# Altium schematic sheet MotorSchematic.SchDoc
size A; Organization: Smart Product Design Lab; Address1: 201 Thornton; Address2: Stanford University; Address3: Stanford, CA; Address4: 94305-4021
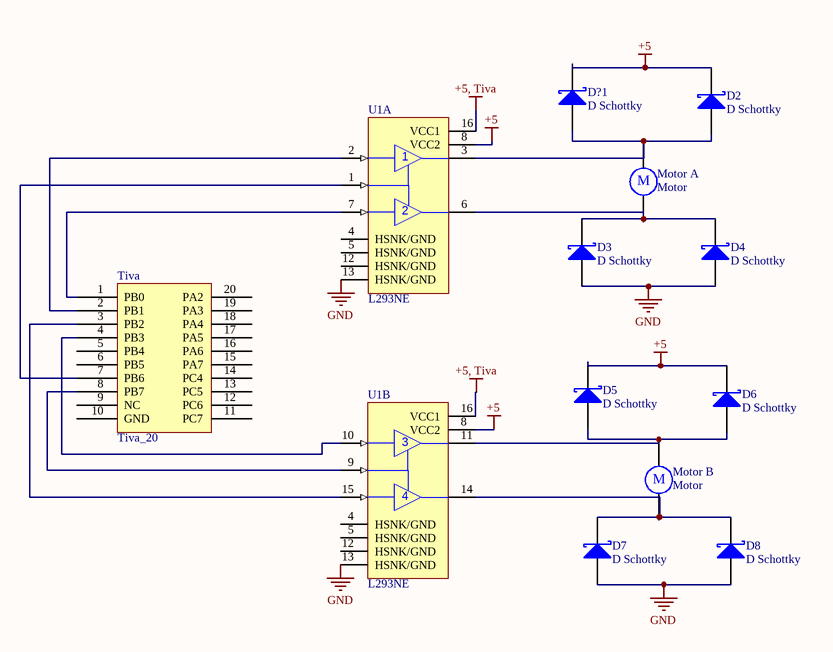
[diagram p0: MotorSchematic.SchDoc]

## Parts
D2  D Schottky  [DSO-C2/X2.3]
D3  D Schottky  [DSO-C2/X2.3]
D4  D Schottky  [DSO-C2/X2.3]
D5  D Schottky  [DSO-C2/X2.3]
D6  D Schottky  [DSO-C2/X2.3]
D7  D Schottky  [DSO-C2/X2.3]
D8  D Schottky  [DSO-C2/X2.3]
D?1  D Schottky  [DSO-C2/X2.3]
Motor_A  Motor  [RB5-10.5]
Motor_B  Motor  [RB5-10.5]
Tiva  Tiva_20
U1  L293NE  [DIP-16/X1.5]  (parts A,B of 2)

## Nets
+5: D2.2(K) D5.2(K) D6.2(K) D?1.2(K) U1.8(VCC2)
+5, Tiva: U1.16(VCC1)
GND: D3.1(A) D4.1(A) D7.1(A) D8.1(A) U1.13(HSNK/GND)
NetD2_1: D2.1(A) D?1.1(A) Motor_A.1 U1.3(1Y)
NetD3_2: D3.2(K) D4.2(K) Motor_A.2 U1.6(2Y)
NetD5_1: D5.1(A) D6.1(A) Motor_B.1 U1.11(3Y)
NetD7_2: D7.2(K) D8.2(K) Motor_B.2 U1.14(4Y)
NetTiva_1: Tiva.1(PB0) U1.7(2A)
NetTiva_2: Tiva.2(PB1) U1.2(1A)
NetTiva_3: Tiva.3(PB2) U1.15(4A)
NetTiva_4: Tiva.4(PB3) U1.10(3A)
NetTiva_7: Tiva.7(PB6) U1.1(1,2EN)
NetTiva_8: Tiva.8(PB7) U1.9(3,4EN)

Not connected (* = marked no-connect by the designer): Tiva 5(PB4) 6(PB5) 9(NC) 10(GND) 11(PC7) 12(PC6) 13(PC5) 14(PC4) 15(PA7) 16(PA6) 17(PA5) 18(PA4) 19(PA3) 20(PA2); U1 4(HSNK/GND) 5(HSNK/GND) 12(HSNK/GND)

## Notes on the sheet
- Title
- Size:
- Date:
- File:
- A
- Number:
- Time:
- Revision:
- Sheet
- of
- Drawn By:
- (in symbol Motor) M

## Library data of the parts
D2-D8 D?1 = D Schottky: Schottky Diode; Manufacturer: Generic Components; Class: Discrete; SubClass: Diode - Schottky; Published: 08/06/2000; Publisher: Altium Hobart Technology Centre
Motor_A Motor_B = Motor: Motor, General Kind; Manufacturer: Generic Components; Published: 1999
Tiva = Tiva_20: Tiva Protection 20 Pin Connector
U1 = L293NE: Quadruple Half-H Driver; Manufacturer: Texas Instruments; Class: Interface; SubClass: Peripheral Driver; Published: 15/05/2002; Publisher: Altium Hobart Technology Centre